# Altium schematic sheet XL6009.SchDoc
size B
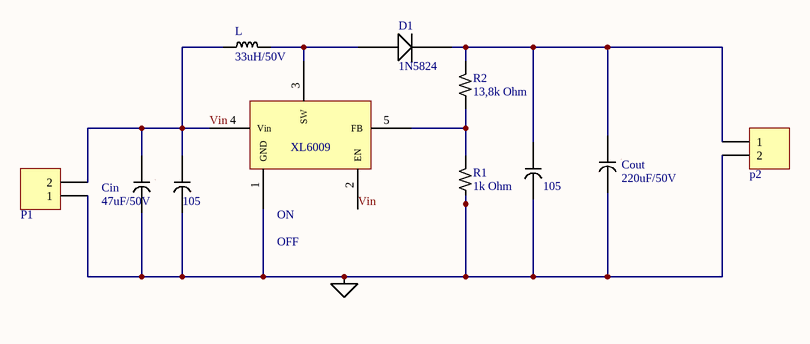
[diagram p0: XL6009.SchDoc]

## Parts
1  105  [PCBComponent_1]
105  105  [PCBComponent_1]  (value not drawn)
*  Component_1  (value not drawn)
Cin  47uF/50V  [PCBComponent_1]
Cout  220uF/50V  [PCBComponent_1]
D1  1N5824  [1N5824]
L  33uH/50V  [PCBComponent_1]
P1  Domino 2  [DOMINO SMALL 2]  (value not drawn)
p2  Domino 2  [DOMINO SMALL 2]  (value not drawn)
R1  1k Ohm  [PCBComponent_1]
R2  13,8k Ohm  [PCBComponent_1]
XL6009  XL6009  [XL6009]  (value not drawn)

## Nets
GND: 1.2 105.2 Cin.2 Cout.2 P1.1 p2.2 R1.1 XL6009.1(GND)
Vin: 105.1 Cin.1 L.1 P1.2 XL6009.2(EN) XL6009.4(Vin)
Net1_1: 1.1 Cout.1 D1.1 p2.1 R2.2
NetD1_2: D1.2 L.2 XL6009.3(SW)
NetR1_2: R1.2 R2.1 XL6009.5(FB)

## Notes on the sheet
- (near *) ON
- (near *) OFF

## Library data of the parts
Cin Cout = capacitor
D1 = diode
L = Electrolytic Cap
P1 p2 = Domino 2: Domino, 2-Pin; LatestRevisionDate: 17-Jul-2002; LatestRevisionNote: Re-released for DXP Platform.; Publisher: Altium Limited
R1 R2 = resistor